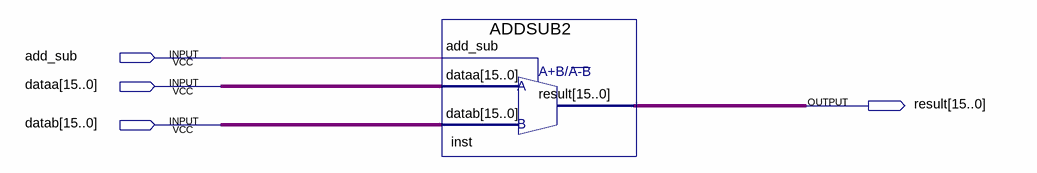
[diagram p0: schematic sheet]
// Quartus schematic lab402LPMADDSUB.bdf as structural Verilog: 1 symbols, 4 pins
module lab402LPMADDSUB (
  input  add_sub,
  input  [15:0] dataa,
  input  [15:0] datab,
  output [15:0] result
);

  ADDSUB2 inst (.add_sub(add_sub), .dataa(dataa), .datab(datab), .result(result));
endmodule
